# EAGLE design sparrow_v4.2 (EAGLE 9.7.0)
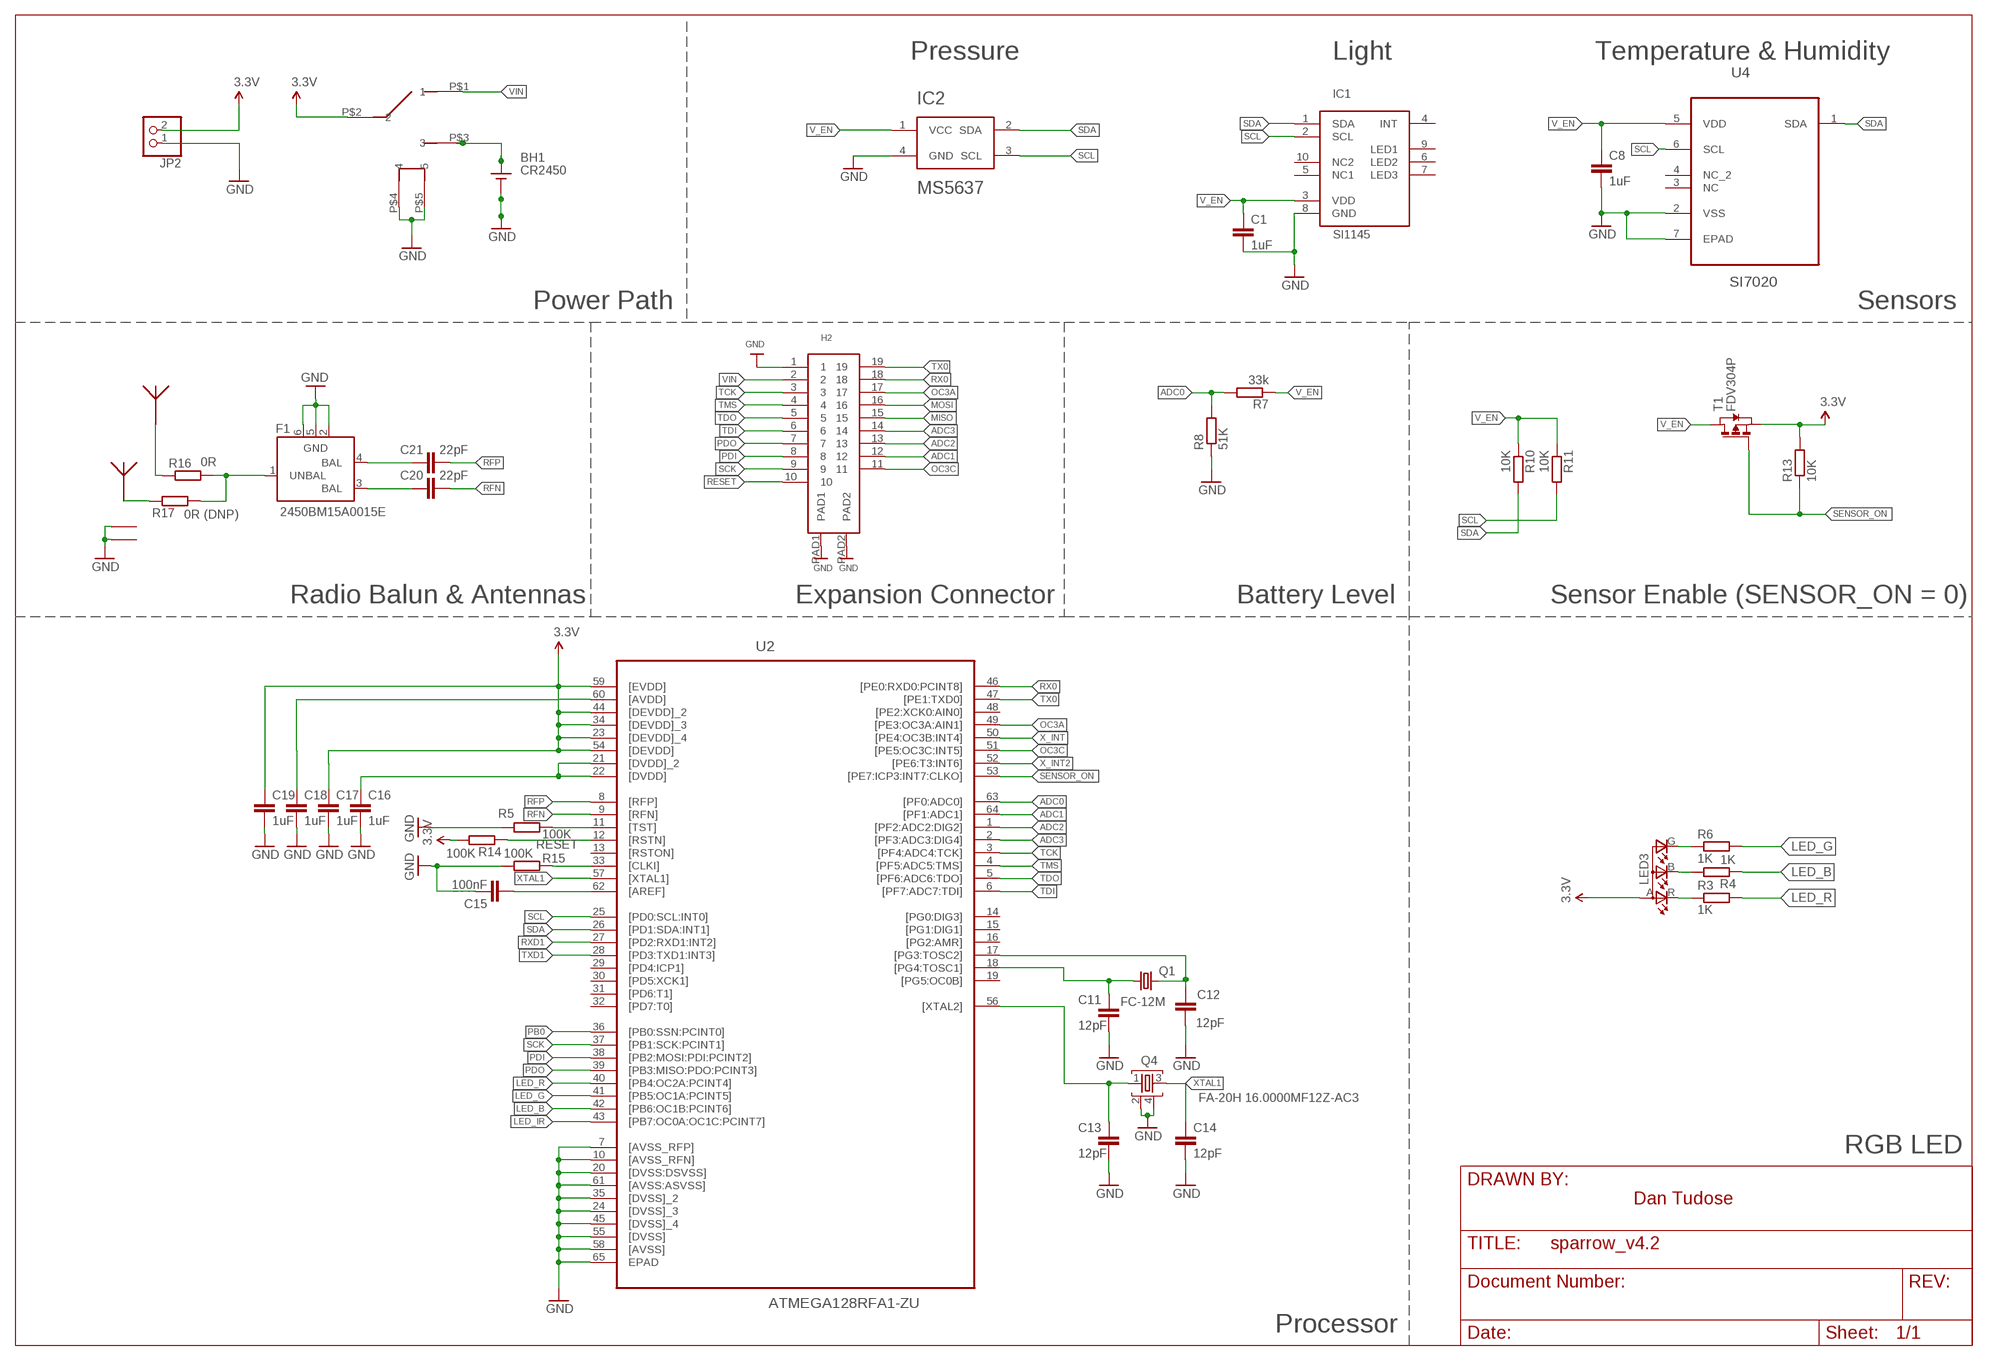
[diagram p0: schematic, sheet 1]

## Parts
C1  1uF  C-EUC0402  [C0402]
C8  1uF  C-EUC0402  [C0402]
C11  12pF  C-EUC0402  [C0402]
C12  12pF  C-EUC0402  [C0402]
C13  12pF  C-EUC0402  [C0402]
C14  12pF  C-EUC0402  [C0402]
C15  100nF  C-EUC0402  [C0402]
C16  1uF  C-EUC0402  [C0402]
C17  1uF  C-EUC0402  [C0402]
C18  1uF  C-EUC0402  [C0402]
C19  1uF  C-EUC0402  [C0402]
C20  22pF  C-EUC0402  [C0402]
C21  22pF  C-EUC0402  [C0402]
F1  2450BM15A0015E  2450BM15A0002  [2450BM15A0002]
H2  DF9-19P-1V(32)  [DF9-19P-1V(32)]
IC1  SI1145  [QFN10]
IC2  MS5637  [MS5637]
JP2  PINHD-1X2  [1X02]
LED3  LED_RGB_CREE_PLCC4  [P-LCC-4-4]
Q1  FC-12M  [FC-12M]
Q4  FA-20H 16.0000MF12Z-AC3  FA-20H  [FA-20H]
R3  1K  R-EU_R0402  [R0402]
R4  1K  R-EU_R0402  [R0402]
R5  100K  R-EU_R0402  [R0402]
R6  1K  R-EU_R0402  [R0402]
R7  33k  R-EU_R0402  [R0402]
R8  51K  R-EU_R0402  [R0402]
R10  10K  R-EU_R0402  [R0402]
R11  10K  R-EU_R0402  [R0402]
R13  10K  R-EU_R0402  [R0402]
R14  100K  R-EU_R0402  [R0402]
R15  100K  R-EU_R0402  [R0402]
R16  0R  R-EU_R0402  [R0402]
R17  0R (DNP)  R-EU_R0402  [R0402]
T1  FDV304P  PMOSSOT23  [SOT-23]
U1  SMTU2450N-LF  RENATA_BAT  [BATPACK]
U2  ATMEGA128RFA1-ZU  [QFN50P900X900X90-64N]
U4  SI7020  SHT21  [DFN300X300X110-7N]
U8  ANTENNA  [ANTPACK]
U10  UFL-R-SMT  [U.FLPACK]
U$1  SWITCH  [PCM12]

## Nets
3.3V: C17.1 C19.1 JP2.2 LED3.A(A2) R13.2 R14.2 T1.2(S) U2.23([DEVDD]_4) U2.34([DEVDD]_3) U2.44([DEVDD]_2) U2.54([DEVDD]) U2.59([EVDD]) U$1.P$2
ADC0: R7.2 R8.2 U2.63([PF0:ADC0])
ADC1: H2.12 U2.64([PF1:ADC1])
ADC2: H2.13 U2.1([PF2:ADC2:DIG2])
ADC3: H2.14 U2.2([PF3:ADC3:DIG4])
GND: C1.2 C8.2 C11.2 C12.2 C13.2 C14.2 C15.1 C16.2 C17.2 C18.2 C19.2 F1.2(GND) F1.5(GND) F1.6(GND) H2.1 H2.PAD1 H2.PAD2 IC1.8(GND) IC2.4(GND) JP2.1 Q4.2 Q4.4 R5.2 R8.1 R15.2 U1.P$2 U2.7([AVSS_RFP]) U2.10([AVSS_RFN]) U2.20([DVSS:DSVSS]) U2.24([DVSS]_3) U2.35([DVSS]_2) U2.45([DVSS]_4) U2.55([DVSS]) U2.58([AVSS]) U2.61([AVSS:ASVSS]) U2.65(EPAD) U4.2(VSS) U4.7(EPAD) U10.GND1 U10.GND2 U$1.P$4 U$1.P$5
LED_B: R4.1 U2.42([PB6:OC1B:PCINT6])
LED_G: R6.2 U2.41([PB5:OC1A:PCINT5])
LED_IR: U2.43([PB7:OC0A:OC1C:PCINT7])
LED_R: R3.2 U2.40([PB4:OC2A:PCINT4])
MISO: H2.15
MOSI: H2.16
N$1: U1.P$1 U$1.P$3
N$2: C16.1 U2.21([DVDD]_2) U2.22([DVDD])
N$3: LED3.R(CRED) R3.1
N$5: C12.1 Q1.2 U2.17([PG3:TOSC2])
N$6: C11.1 Q1.1 U2.18([PG4:TOSC1])
N$9: LED3.B(CBLUE) R4.2
N$10: LED3.G(CGREEN) R6.1
N$11: C18.1 U2.60([AVDD])
N$17: R5.1 U2.11([TST])
N$19: C13.1 Q4.1 U2.56([XTAL2])
N$22: R15.1 U2.33([CLKI])
N$23: C15.2 U2.62([AREF])
N$26: C20.1 F1.3(BAL)
N$27: C21.1 F1.4(BAL)
N$28: F1.1(UNBAL) R16.2 R17.1
N$29: R16.1 U8.P$1
N$30: R17.2 U10.P$1
OC3A: H2.17 U2.49([PE3:OC3A:AIN1])
OC3C: H2.11 U2.51([PE5:OC3C:INT5])
PB0: U2.36([PB0:SSN:PCINT0])
PDI: H2.8 U2.38([PB2:MOSI:PDI:PCINT2])
PDO: H2.7 U2.39([PB3:MISO:PDO:PCINT3])
RESET: H2.10 R14.1 U2.12([RSTN])
RFN: C20.2 U2.9([RFN])
RFP: C21.2 U2.8([RFP])
RX0: H2.18 U2.46([PE0:RXD0:PCINT8])
RXD1: U2.27([PD2:RXD1:INT2])
SCK: H2.9 U2.37([PB1:SCK:PCINT1])
SCL: IC1.2(SCL) IC2.3(SCL) R11.2 U2.25([PD0:SCL:INT0]) U4.6(SCL)
SDA: IC1.1(SDA) IC2.2(SDA) R10.2 U2.26([PD1:SDA:INT1]) U4.1(SDA)
SENSOR_ON: R13.1 T1.3(G) U2.53([PE7:ICP3:INT7:CLKO])
TCK: H2.3 U2.3([PF4:ADC4:TCK])
TDI: H2.6 U2.6([PF7:ADC7:TDI])
TDO: H2.5 U2.5([PF6:ADC6:TDO])
TMS: H2.4 U2.4([PF5:ADC5:TMS])
TX0: H2.19 U2.47([PE1:TXD0])
TXD1: U2.28([PD3:TXD1:INT3])
V_EN: C1.1 C8.1 IC1.3(VDD) IC2.1(VCC) R7.1 R10.1 R11.1 T1.1(D) U4.5(VDD)
VIN: H2.2 U$1.P$1
X_INT: U2.50([PE4:OC3B:INT4])
X_INT2: U2.52([PE6:T3:INT6])
XTAL1: C14.1 Q4.3 U2.57([XTAL1])
Unconnected: IC1.4(INT) IC1.5(NC1) IC1.6(LED2) IC1.7(LED3) IC1.9(LED1) IC1.10(NC2) U2.13([RSTON]) U2.14([PG0:DIG3]) U2.15([PG1:DIG1]) U2.16([PG2:AMR]) U2.19([PG5:OC0B]) U2.29([PD4:ICP1]) U2.30([PD5:XCK1]) U2.31([PD6:T1]) U2.32([PD7:T0]) U2.48([PE2:XCK0:AIN0]) U4.3(NC) U4.4(NC_2)

## Notes on the sheet
- Pressure | Light | Temperature & Humidity
- BH1
- CR2450
- Power Path | Sensors
- Radio Balun & Antennas | Expansion Connector | Battery Level | Sensor Enable (SENSOR_ON = 0)
- RGB LED
- DRAWN BY:
- Dan Tudose
- Processor

## Library data of the parts
C1 C8 C11-C21 = resistor:C-EU: CAPACITOR, European symbol
F1 = johanson:2450BM15A0002: 2.45 GHz Impedance Matched Balun-Filter For TI CC253X/CC2540 Chipset family Data sheet <http://www.johansontechnology.com/images/stories/ip/baluns/balun_filter_combo_matched_2450bm15a0002_v8.pdf>
H2 = dan:DF9-19P-1V(32)
IC1 = dan:SI1145
IC2 = dan:MS5637
JP2 = pinhead:PINHD-1X2: PIN HEADER
LED3 = led:LED_RGB_CREE_PLCC4
Q1 = crystal:FC-12M: kHz RANGE CRYSTAL UNIT LOW PROFILE SMD Source: Epson Toyocom FC-12M.pdf
Q4 = smartwatch:FA-: MHz RANGE CRYSTAL UNIT Source: Epson Toyocom
R3 R4 R6 = rcl:R-EU_: RESISTOR, European symbol
R5 R7 R8 R10 R11 R13-R17 = resistor:R-EU_: RESISTOR, European symbol
T1 = zetex:PMOSSOT23: MOS FET; OC_FARNELL: unknown; OC_NEWARK: unknown
U1 = 0andrei_custom:RENATA_BAT
U2 = Atmel_By_element14_Batch_1-00:ATMEGA128RFA1-ZU: 8-bit Microcontroller; DESCRIPTION: 8-bit Microcontroller; MPN: ATMEGA128RFA1-ZU; OC_FARNELL: 1841596; OC_NEWARK: -; PACKAGE: QFN-64; SUPPLIER: Atmel
U4 = sensirion:SHT21: SENSOR, HUMIDITY & TEMP; MPN: SHT21; OC_FARNELL: 1855468; OC_NEWARK: 20T1172; PACKAGE: DFN-6; SUPPLIER: SENSIRION
U8 = 0andrei_custom:ANTENNA
U10 = 0andrei_custom:UFL-R-SMT
U$1 = dan:SWITCH

## Board
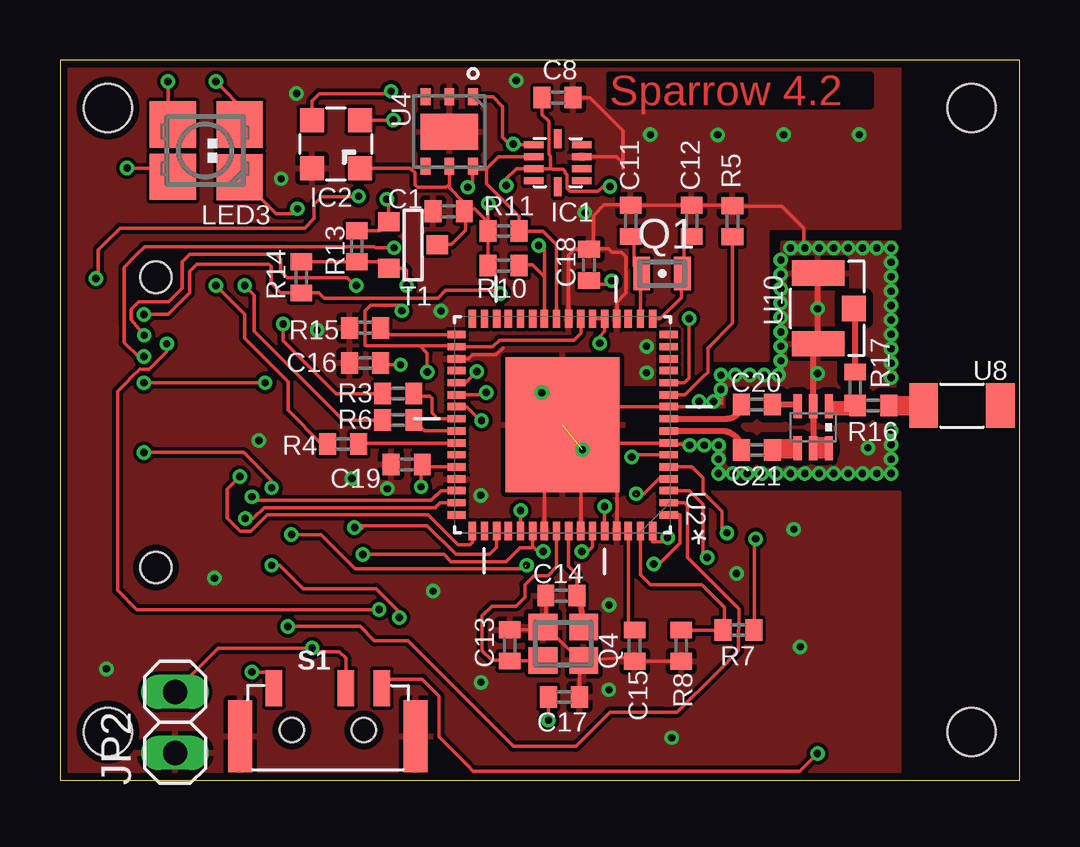
[diagram p1: board, top side]
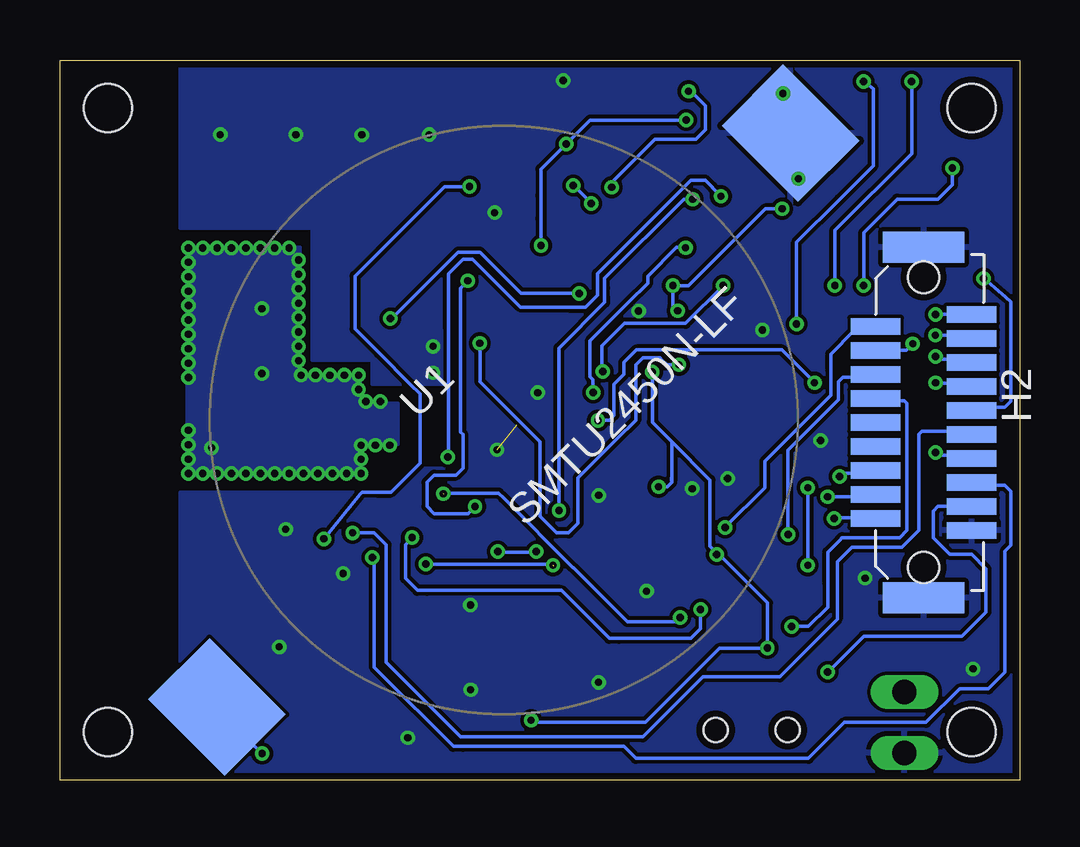
[diagram p2: board, bottom side, seen from below]

Size 40 x 30 mm. Coordinates in mm from the lower left corner, seen from the top.
Outline: 0,0 40,0 40,30 0,30 0,0
Copper layers (1*16): Top 0.035mm / dielectric 1.5mm / Bottom 0.035mm
Design rules "Fusion Electronics Design Rules": minimum track width 0.15mm, minimum drill 0.3mm, track to track 0.15mm, track to pad 0.15mm, pad to pad 0.15mm, via to via 0.15mm, smd to smd 0.15mm, copper to edge 0.3mm, drill to drill 0.2mm, minimum pad ring 0.2mm, minimum via ring 0.15mm, stop-mask expansion 0.075mm, vias tented up to drill 15mil, thermal gap 0.2mm
Holes 2 mm at 2,28 38,2 2,2 38,28

### Footprints (pad centres in the part's own frame; a part is rotated, then mirrored left to right if it is on the bottom)
C0402 = smd 0.7 x 0.9: 1 -0.65,0; 2 0.65,0
2450BM15A0002 = smd 0.35 x 1: 1 -0.65,-0.875; 2 0,-0.875; 3 0.65,-0.875; 4 0.65,0.875; 5 0,0.875; 6 -0.65,0.875
DF9-19P-1V(32) = smd 0.7 x 2.08: 1 -4.5,-2; 2 -3.5,-2; 3 -2.5,-2; 4 -1.5,-2; 5 -0.5,-2; 6 0.5,-2; 7 1.5,-2; 8 2.5,-2; 9 3.5,-2; 10 4.5,-2; 11 4,2; 12 3,2; 13 2,2; 14 1,2; 15 0,2; 16 -1,2; 17 -2,2; 18 -3,2; 19 -4,2 | smd 1.3 x 3.4: PAD1 7.3,0; PAD2 -7.3,0 | hole 1.3: 6.05,0; -6.05,0
QFN10 = smd 0.8 x 0.3: 1 1,1.5; 2 1,1; 3 1,0.5; 4 1,0; 6 3,0; 7 3,0.5; 8 3,1; 9 3,1.5 | smd 0.3 x 0.8: 5 2,-0.25; 10 2,1.75
MS5637 = smd 1 x 1: 1 -1,1; 2 -1,-1; 3 1,-1; 4 1,1
1X02 = drill 1.016 long: 1 -1.27,0; 2 1.27,0
P-LCC-4-4 = smd 1.93 x 1.93: A -1.088,-1.39; B -1.063,1.39; G 1.113,1.39; R 1.113,-1.39
FC-12M = smd 0.7 x 1.4: 1 -0.85,0; 2 0.85,0
FA-20H = smd 1.2 x 1.1: 1 -0.85,-0.7; 2 0.85,-0.7; 3 0.85,0.7; 4 -0.85,0.7
R0402 = smd 0.7 x 0.9: 1 -0.65,0; 2 0.65,0
SOT-23 = smd 0.787 x 0.889: 1 0.025,-1.016; 2 -0.94,1.016; 3 0.991,1.016
BATPACK = smd 3.6 x 4.5: P$1 -16.9,0; P$2 16.9,0
QFN50P900X900X90-64N = smd 0.762 x 0.305: 1 -4.42,3.759; 2 -4.42,3.251; 3 -4.42,2.743; 4 -4.42,2.261; 5 -4.42,1.753; 6 -4.42,1.245; 7 -4.42,0.762; 8 -4.42,0.254; 9 -4.42,-0.254; 10 -4.42,-0.762; 11 -4.42,-1.245; 12 -4.42,-1.753; 13 -4.42,-2.261; 14 -4.42,-2.743; 15 -4.42,-3.251; 16 -4.42,-3.759; 33 4.42,-3.759; 34 4.42,-3.251; 35 4.42,-2.743; 36 4.42,-2.261; 37 4.42,-1.753; 38 4.42,-1.245; 39 4.42,-0.762; 40 4.42,-0.254; 41 4.42,0.254; 42 4.42,0.762; 43 4.42,1.245; 44 4.42,1.753; 45 4.42,2.261; 46 4.42,2.743; 47 4.42,3.251; 48 4.42,3.759 | smd 0.305 x 0.762: 17 -3.759,-4.42; 18 -3.251,-4.42; 19 -2.743,-4.42; 20 -2.261,-4.42; 21 -1.753,-4.42; 22 -1.245,-4.42; 23 -0.762,-4.42; 24 -0.254,-4.42; 25 0.254,-4.42; 26 0.762,-4.42; 27 1.245,-4.42; 28 1.753,-4.42; 29 2.261,-4.42; 30 2.743,-4.42; 31 3.251,-4.42; 32 3.759,-4.42; 49 3.759,4.42; 50 3.251,4.42; 51 2.743,4.42; 52 2.261,4.42; 53 1.753,4.42; 54 1.245,4.42; 55 0.762,4.42; 56 0.254,4.42; 57 -0.254,4.42; 58 -0.762,4.42; 59 -1.245,4.42; 60 -1.753,4.42; 61 -2.261,4.42; 62 -2.743,4.42; 63 -3.251,4.42; 64 -3.759,4.42 | smd 4.75 x 5.639: 65 0,0
DFN300X300X110-7N = smd 0.711 x 0.406: 1 -1.448,0.991; 2 -1.448,0; 3 -1.448,-0.991; 4 1.448,-0.991; 5 1.448,0; 6 1.448,0.991 | smd 1.499 x 2.388: 7 0,0
ANTPACK = smd 1.2 x 1.85: P$1 -1.6,0; P$2 1.6,0
U.FLPACK = smd 1.05 x 2.2: GND1 -1.475,0; GND2 1.475,0 | smd 1.05 x 1: P$1 0,-1.5
PCM12 = smd 0.7 x 1.5: P$1 0,0; P$2 3,0; P$3 4.5,0 | smd 1 x 3: P$4 -1.4,-2; P$5 5.9,-2 | hole 1: 0.75,-1.75; 3.75,-1.75

### Placement (x,y rotation side)
C1  16.2,23.7 180 top
C8  20.74,28.43 0 top
C11  23.79,23.3 90 top
C12  26.33,23.3 90 top
C13  18.75,5.61 90 top
C14  20.9,7.68 180 top
C15  23.95,5.6 90 top
C16  12.72,17.38 180 top
C17  21.01,3.46 0 top
C18  22.05,21.46 90 top
C19  14.45,13.15 180 top
C20  29.05,15.65 180 top
C21  29.05,13.75 180 top
F1  31.4,14.7 180 top
H2  4,14.9 90 bottom
IC1  18.75,24.97 0 top
IC2  11.5,26.5 180 top
JP2  4.8,2.4 90 top
LED3  6.1,26.2 90 top
Q1  25.1,21.1 0 top
Q4  20.98,5.68 0 top
R3  14.1,16.1 0 top
R4  11.8,14 180 top
R5  28.03,23.28 90 top
R6  14.1,15 0 top
R7  28.28,6.25 180 top
R8  25.9,5.6 90 top
R10  18.49,21.43 0 top
R11  18.49,22.87 0 top
R13  12.38,22.24 270 top
R14  10.06,20.94 90 top
R15  12.72,18.84 180 top
R16  33.9,15.6 180 top
R17  33.15,16.35 90 top
T1  14.72,22.27 90 top
U1  21.5,15 45 bottom
U2  20.95,14.8 180 top
U4  16.23,27.02 270 top
U8  37.6,15.6 0 top
U10  31.6,19.65 90 top
U$1  8.92,3.83 0 top

### Tracks (layer width: path | path; a pad name or v marks a point on that pad's centre or on a via)
3.3V  (via drill 0.3)
  Top 0.15: 13.44,21.59 R13.2 R14.2 | 15.1,13.05 C19.1 | C19.1 15.05,13.15 v15.05,12.22 | v10.51,5.5 10.66,5.35 11.64,5.35 11.92,5.07 U$1.P$2 | 19.7,9.72 U2.54 | 19.7,9.72 19.65,9.68 19.38,9.68 19.18,9.68 19.1,9.6 18.6,9.1 16.3,9.1 16,9.4 12.6,9.4 v12.62,9.4 | v21.75,9.53 22,9.53 22.2,9.72 22.2,10.32 U2.59 | v20.15,9.53 19.9,9.53 19.75,9.68 19.7,9.72 | v14.45,20.6 14.45,21.25 14.38,21.32 13.82,21.32 T1.2 | v14.25,19.55 14.22,19.77 12.95,19.77 12.72,19.55 12.72,18.12 12.75,18.1 15,18.1 | JP2.2 4.8,3.7 6.6,5.5 v10.51,5.5 | v10.51,5.5 10.6,5.5 v10.51,5.5 | LED3.A 7.59,25.01 9,23.6 9.7,23.6 v9.9,23.8 | 15,18.1 15.1,18.1 16.5,18.1 | 16.5,18.1 16.53,18.1 | v15.31,17 15.31,17.79 15,18.1 | U2.23 21.71,18.61 21.43,18.33 18.32,18.33 18.04,18.05 U2.34 16.53,18.07 16.5,18.1 | U2.44 15.05,13.05 | 15.05,13.05 15,13.1 | 15.05,13.05 15.05,13.1 C19.1 | C17.1 v20.36,2.49
  Top 0.254: 13.44,21.59 T1.2 | U2.23
  Bottom 0.15: v21.75,9.53 21.43,9.5 20.27,9.5 v20.15,9.53 | 14.51,12.46 14.51,12.6 14.5,12.59 14.5,12.5 | 20.4,2.5 20.3,2.4 15.6,2.4 12.52,5.48 10.53,5.48 v10.51,5.5 10.51,7.38 12.58,9.45 v12.62,9.4 12.59,9.44 12.9,9.75 12.9,9.9 12.9,12.5 14.5,14.1 | 20.4,2.5 20.3,2.5 20.4,2.5 | v20.36,2.49 20.39,2.49 20.4,2.5 | v14.25,19.55 14.45,19.75 v14.45,20.6 13.8,20.6 10.6,23.8 v9.9,23.8 | 14.5,14.1 14.5,14 14.5,12.5 | 14.5,12.5 14.5,12.47 | v15.05,12.22 14.68,12.22 14.5,12.4 14.5,12.5 | v15.31,17 15.31,14.91 14.5,14.1
ADC0
  Top 0.15: U2.63 24.2,8.55 24.61,8.14 25.42,8.14 26.76,8.14 27.7,7.2 27.7,6.4 27.6,6.3 27.6,6.28 R7.2 R8.2
ADC1  (via drill 0.3)
  Top 0.15: v25.32,10.1 25.15,9.93 24.7,9.93 U2.64 | v4.45,18.18 4.45,17.85 3.73,17.12 3.33,17.12 2.98,16.77 2.8,16.6 2.4,16.2 2.4,7.9 3.2,7.1 3.3,7.1 v13.3,7.1
  Bottom 0.15: v4.45,18.18 4.72,17.9 H2.12 | v13.3,7.1 13.3,6.3 13.7,5.9 16.7,5.9 17.1,5.9 19.1,7.9 19.15,7.9 24.7,7.9 25.1,7.9 25.6,8.4 25.6,9.8 25.3,10.1 v25.32,10.1
ADC2  (via drill 0.3)  (1 unrouted)
  Top 0.15: v24.75,9 24.98,9 25.85,9.88 25.85,11.05 U2.1 | 19.6,9 19.55,8.95 v19.45,8.95 | v9.65,10.22 10.88,10.22 12.3,8.8 19.3,8.8 19.4,8.9
  Bottom 0.15: v19.45,8.95 19.6,9 23.27,9 24.7,9 v24.75,9 | H2.13 6.72,16.9 6.85,16.77 7.38,16.77 7.55,16.6 7.55,16.02 7.55,15.85 7.7,15.7 | v9.65,10.22 9.65,13.75 7.85,15.55 | 7.85,15.55 7.7,15.7 | 7.7,15.7 7.85,15.55
ADC3  (via drill 0.3)
  Top 0.15: U2.2 26.02,11.55 26.15,11.43 26.15,9.29 28.3,7.14 28.29,5.4 28.26,5.36 27.4,4.5 25.73,2.83 25.15,2.83 22.93,2.83 21.5,1.4 18.9,1.4 14.5,5.8 13.1,5.8 12.5,6.4 v9.5,6.4
  Bottom 0.15: H2.14 5.28,15.9 5.15,15.78 5.12,15.78 5.1,15.8 | 4.8,15.8 5.1,15.8 | 5.1,15.8 5.2,15.8 | 5.2,15.8 5.8,15.8 5.2,15.8 | 8.8,6.4 8,7.2 8,8.2 8,9.5 7.5,10 7.4,10.1 5,10.1 4.7,10.4 4.7,15.7 | v9.5,6.4 9,6.4 8.8,6.4 | v9.5,6.4 8.8,6.4 | 8.8,6.4 v9.5,6.4 | 4.7,15.7 4.8,15.8 | 4.8,15.8 4.7,15.7
GND  (via drill 0.3)  (1 unrouted)
  Top 0.15: 21.71,15.56 U2.10 26.44,15.56 v26.65,15.77 v27.25,15.77 27.53,15.77 27.6,15.7 27.6,16.22 v27.55,16.27 | U2.7 21.83,14.04 | U2.58 21.71,13.92 | U2.61 23.21,13.08 | U2.55 20.19,13.36 | C14.2 20.25,6.26 C13.2 | R8.1 C15.1 | C17.2 21.66,5.06 | Q4.2 23.8,5.11 | 21.55,5.11 20.78,5.87 20.7,5.95 20.56,5.95 Q4.4 | IC1.8 23.2,25.97 23.46,25.71 23.46,25.5 23.46,27.06 22.09,28.43 C8.2 | C11.2 C12.2 28.01,23.95 R5.2 | U2.24 21.2,21.87 21.44,22.11 C18.2 | 22.08,22.14 22.79,22.14 22.86,22.14 23,22 23.4,22 23.6,21.8 23.6,20.3 23.21,19.91 U2.20 | 23.46,23.96 22.68,23.96 22.24,23.52 22.24,22.3 | 7.15,2.58 7.15,1.85 7.14,1.85 | U2.35 17.03,17.54 17.2,17.71 17.6,17.71 18.18,17.71 18.46,17.99 | U2.65 20.95,15.3 20.11,16.14 | 20.11,16.14 20.08,16.17 | v20.08,16.14 20.11,16.14 | v26.25,13.95 26.13,13.97 26.1,14 25.4,14 | v26.85,13.95 v27.45,13.95 | v29.95,16.87 30.07,16.87 30.1,16.9 30.1,17.42 v30.05,17.47 v30.05,18.07 | v30.05,18.67 v30.05,19.27 | v30.05,21.07 v30.05,20.47 v30.05,21.07 | v30.05,21.07 v30.05,21.67 | v30.45,22.17 v31.05,22.17 | v31.05,22.17 v31.65,22.17 v32.25,22.17 | v32.85,22.17 v33.45,22.17 | 28.04,23.9 30.1,23.9 31,23 31,22.22 v31.05,22.17
  Top 0.254: F1.6 F1.5 F1.2 31.4,17.98 U10.GND1 U10.GND2 | 21.71,15.56 arc90 U2.65 arc90 21.71,14.04 21.83,14.04 arc90 21.71,13.92 | 23.21,13.08 arc90 21.56,14.73 arc90 20.19,13.36 | 21.66,5.06 Q4.2 21.55,5.11 | 23.8,5.11 C15.1 | 23.46,23.96 C11.2 | 22.08,22.14 C18.2 22.24,22.3 | 20.25,6.26 arc90 Q4.4 arc90 20.25,6.26
  Bottom 0.15: U1.P$2 9.55,28.29 v9.86,28.6 | v9.86,28.6 v9.87,28.61 v9.86,28.6
  other vias: 6.43,8.41 12.17,12.56 21.78,13.76 17.54,11.86 27.42,26.88 33.32,26.89 30.17,26.89 24.61,26.89 8.29,14.15 13.65,12.14 9.22,25.05 25.5,1.76 30.86,5.55 30.59,10.45 28.2,8.6 22.89,7.29 22.88,3.76 1.94,4.63 27.55,16.87 28.15,16.87 28.75,16.87 29.35,16.87 30.05,19.87 34.05,22.17 34.65,22.17 34.65,21.57 34.65,20.97 34.65,20.37 34.65,19.77 34.65,19.17 34.65,18.57 34.65,17.97 34.65,17.37 34.65,16.77 34.65,14.57 34.65,13.97 34.65,13.37 34.65,12.77 34.05,12.77 33.45,12.77 32.85,12.77 32.25,12.77 31.65,12.77 31.05,12.77 30.45,12.77 29.85,12.77 29.25,12.77 28.65,12.77 28.05,12.77 27.45,12.77 27.45,13.37 31.58,16.94 31.58,19.64 33.68,13.84 21.88,23.64 10.72,18.75 19.02,29.15 15.88,19.54 24.45,18.07 24.45,16.97 15.55,7.87 17.55,4.07
  pour Top (isolate 0.305): 27.39,13.97 27.4,13.94 27.4,12.7 34.7,12.7 34.7,13.84 34.71,13.87 34.73,13.89 34.76,13.9 34.8,13.9 34.8,22.4 30.1,22.4 30.1,16.96 30.09,16.93 30.07,16.91 30.04,16.9 27.6,16.9 27.6,15.76 27.59,15.73 27.57,15.71 27.54,15.7 26.4,15.7 26.4,15.56 26.39,15.53 26.37,15.51 26.34,15.5 25.3,15.5 25.3,14 27.34,14 27.37,13.99
  pour Bottom: 27,12.06 27,13 23.56,13 23.53,13.01 23.51,13.03 23.5,13.06 23.5,16.44 23.51,16.47 23.53,16.49 23.56,16.5 27,16.5 27,17.44 27.01,17.47 27.03,17.49 27.06,17.5 29.5,17.5 29.5,22.94 29.51,22.97 29.53,22.99 29.56,23 35,23 35,30 0,30 0,0 35,0 35,12 27.06,12 27.03,12.01 27.01,12.03
  pour Top: 27,12.06 27,13 23.56,13 23.53,13.01 23.51,13.03 23.5,13.06 23.5,16.44 23.51,16.47 23.53,16.49 23.56,16.5 27,16.5 27,17.44 27.01,17.47 27.03,17.49 27.06,17.5 29.5,17.5 29.5,22.94 29.51,22.97 29.53,22.99 29.56,23 35,23 35,30 0,30 0,0 35,0 35,12 27.06,12 27.03,12.01 27.01,12.03
  pour Bottom: 27.49,13.97 27.5,13.94 27.5,12.7 34.7,12.7 34.7,22.2 30,22.2 30,16.86 29.99,16.83 29.97,16.81 29.94,16.8 27.5,16.8 27.5,15.76 27.49,15.73 27.47,15.71 27.44,15.7 25.9,15.7 25.9,14 27.44,14 27.47,13.99
LED_B
  Top 0.15: U2.42 12.8,14.04 | 12.8,14.04 12.64,14.04 12.6,14 | R4.1 12.76,14 12.8,14.04
LED_G
  Top 0.15: U2.41 15.2,14.55 R6.2
LED_R
  Top 0.15: U2.40 15.75,15.05 15.5,15.3 15.5,15.9 15.4,16 14.85,16 R3.2
N$1  (via drill 0.3)
  Top 0.15: v31.57,1.1 30.85,0.38 21.55,0.38 17.23,0.38 17,0.6 15.8,1.8 15.8,3.5 15.1,4.2 13.4,4.2 13.4,3.9 13.45,3.85 | 13.45,3.85 13.5,3.8 | U$1.P$3 13.45,3.85
  Bottom 0.15: v31.57,1.1 33,2.52 32.98,2.55 33.45,3.02 U1.P$1
N$2  (via drill 0.3)
  Top 0.15: U2.22 U2.21 22.7,18.7 22.5,18.5 v22.5,18.2 | C16.1 13.37,17.47 13.6,17.7 13.6,17.5 13.4,17.3 v14.2,17.3
  Bottom 0.15: v14.2,17.3 14.7,17.3 14.9,17.5 15,17.6 15.7,17.6 16,17.3 16,15 16.8,14.2 18.4,12.6 18.4,10.7 18.8,10.3 19.3,10.3 20,11 20,14.1 21.3,15.4 22.5,16.6 v22.5,18.2
N$3  (via drill 0.3)
  Top 0.15: R3.1 11.5,16.1 11,16.6 9.3,18.3 v9.3,19 | v6.5,29.1 6.7,28.9 7.6,28 7.59,28.01 LED3.R
  Bottom 0.15: v9.3,19 9.3,22.4 7.5,24.2 6.1,25.6 6.1,28.8 v6.5,29.1
N$5
  Top 0.15: U2.17 24.96,19.22 25.02,19.22 25.9,20.1 25.9,21 26,21.1 | 26.12,21.12 26,21 26,21.05 Q1.2 26,21.1 | 26,21.1 26,22.32 C12.1
N$6
  Top 0.15: U2.18 24.2,20.04 24.2,21 | C11.1 23.92,22.52 23.92,21.43 Q1.1 24.25,21.05 24.2,21 | 24.2,21 24.2,21.2
  Top 0.254: 23.82,22.62 C11.1
N$7
  Top 0.6: 34.6,15.7 35.5,15.7 34.6,15.7 | 34.6,15.7 34.6,15.5 35.5,15.5
N$8
  Top 0.6: 33.1,15.5 32.3,15.5
N$9  (via drill 0.3)
  Top 0.15: R4.2 10.9,14 9.5,15.4 9.5,16.6 8.9,17.2 7.7,18.4 7.7,19.4 v6.5,20.6 | LED3.B 4.24,25.38 | 4.24,25.38 4.14,25.44 | v2.8,25.5 4.2,25.5 4.3,25.4 4.26,25.4 4.24,25.38
  Bottom 0.15: v2.8,25.5 2.8,24.8 | v6.5,20.6 6.5,22.8 5.1,24.2 3.4,24.2 2.9,24.7 | 2.9,24.7 2.8,24.8 | 2.8,24.8 2.9,24.7
N$10  (via drill 0.3)
  Top 0.15: v7.7,20.6 8.1,20.2 8.1,18.7 10.1,16.7 11.8,15 R6.1 | v4.5,29.1 4.5,28.3 4.8,28 LED3.G | R6.1 13.5,15 R6.1
  Bottom 0.15: v7.7,20.6 7.7,22.3 7.7,22.9 4.5,26.1 v4.5,29.1
N$11  (via drill 0.3)
  Top 0.15: 22.2,20.66 22.77,20.66 v23,20.8 | v22.7,11.4 U2.60
  Top 0.254: 22.2,20.66 C18.1
  Bottom 0.15: v23,20.8 23.3,20.5 23.3,14.5 23.2,14.4 23.2,13 23.5,12.7 24.4,12.7 24.7,12.4 24.7,11.4 24.4,11.1 23,11.1 v22.7,11.4
N$13
  Top 0.6: 29.7,13.9 30.5,13.9
N$14
  Top 0.6: 30.6,13.8 30.6,13.7 29.8,13.7
N$15
  Top 0.6: 31.6,14 31.9,14 31.9,13.9 31.9,13.7 31.6,13.7
N$17
  Top 0.15: R5.1 28.03,19.03 27,18 27,17 26.8,16.8 26.05,16.05 U2.11
N$19
  Top 0.15: U2.56 20.7,8.88 20.34,8.52 19.76,8.52 19.38,8.14 19.38,7.61 19.01,7.24 18,7.24 17.6,6.84 17.6,5.39 18.01,4.98 18.79,4.98 18.8,4.97 C13.1 20.11,4.96 Q4.1
N$22
  Top 0.15: U2.33 13.65,18.56
  Top 0.254: 13.65,18.56 R15.1
N$23
  Top 0.15: U2.62 23.69,6.51
  Top 0.254: 23.69,6.51 arc90 C15.2
N$26
  Top 0.254: C20.1 30.68,15.65 arc-90 F1.3
N$27
  Top 0.254: C21.1 30.68,13.75 arc90 F1.4
N$28
  Top 0.254: F1.1 33.02,15.57 arc90 R17.1 arc-90 R16.2
N$29
  Top 0.254: R16.1 U8.P$1
N$30
  Top 0.254: R17.2 33.15,19.6 arc90 U10.P$1
OC3A  (via drill 0.3)
  Top 0.15: v7.5,12.65 6.97,12.12 6.97,10.9 7.5,10.38 7.95,10.38 8.62,11.05 12.45,11.05 12.55,11.05 15.35,11.05 16.6,9.8 17.1,9.8 17.2,9.9 17.2,10.4 U2.49
  Bottom 0.15: v7.5,12.65 7.38,12.78 6.85,12.78 6.72,12.9 H2.17
OC3C  (via drill 0.3)
  Top 0.15: 18.2,10.4 U2.51 18.2,10.5 18.2,9.7 17.9,9.4 16.5,9.4 15.3,10.6 12.4,10.6 12.3,10.5 | 12.6,10.5 12.3,10.5 | v12.28,10.53 12.3,10.5
  Bottom 0.15: v12.28,10.53 10.62,12.18 10.62,13.28 7.9,16 7.88,16.02 7.88,16.45 7.88,17.07 7.88,17.75 6.91,18.71 6.9,18.71 6.71,18.9 | H2.11 6.71,18.9 | 6.71,18.9 6.72,18.9 | 6.71,18.9 6.71,18.88 6.73,18.86 6.76,18.86 6.77,18.85 6.77,18.83 6.77,18.82 6.79,18.8 6.83,18.8 7,18.63
PDI  (via drill 0.3)
  Top 0.15: 17.62,16.2 v17.77,16.15 17.73,16.1 17.7,16.1 17.65,16.05 16.55,16.05 U2.38 | v13.93,22.18 13.15,22.18 13.1,22.23 9.35,22.23 3.52,22.23 3.5,22.2 3.2,21.9 2.67,21.38 2.67,19.75 2.67,19.05 2.67,18.23 2.7,18.2 3.25,17.65 v3.5,17.65
  Bottom 0.15: v17.77,16.15 17.77,16.68 17.9,16.8 17.9,18.3 16.3,19.9 15.5,20.7 15.5,21 14.3,22.2 13.9,22.2 13.9,22.1 13.93,22.12 v13.93,22.18 | v3.5,17.65 3.38,17.52 2.85,17.52 2.73,17.4 H2.8
PDO  (via drill 0.3)
  Top 0.15: v3.5,16.55 v8.55,16.55 | U2.39 16.55,15.55 16.93,15.55 16.95,15.55 17.5,15 17.52,14.97 v17.57,14.97
  Bottom 0.15: 14.12,17.93 14.17,17.93 | 14.17,17.93 14.88,17.93 15.97,17.93 16,17.9 16.5,17.4 16.5,16.9 16.9,16.5 16.9,15.2 17.1,15 17.5,15 | v3.5,16.55 3.48,16.52 2.85,16.52 2.73,16.4 H2.7 | v8.55,16.55 8.52,16.54 9.9,17.92 14.14,17.92 14.16,17.92 14.17,17.93 | 17.5,15 17.6,15 | v17.57,14.97 17.52,14.97 17.5,15
RESET  (via drill 0.3)
  Top 0.15: v26.23,19.23 26.23,16.75 26.02,16.55 U2.12 | 9.4,20.3 10,20.3 R14.1 10.07,20.3 10.78,20.3 11,20.07 15.75,20.07 16.07,20.4 17.43,20.4 18.2,20.4 18.3,20.3 18.32,20.27 v18.35,20.27 | 9.4,20.3 9.35,20.3 | v3.5,19.4 4.5,19.4 5.4,20.3 5.4,21.2 5.7,21.5 8.7,21.5 8.8,21.4 8.8,20.7 9.2,20.3 9.4,20.3
  Bottom 0.15: v3.5,19.4 H2.10 | v26.23,19.23 26.2,19.2 25.1,20.3 23.4,22 22.5,22 20.77,20.27 v18.35,20.27
RFN
  Top 0.254: U2.9 27.8,15.05 arc90 C20.2
RFP
  Top 0.254: U2.8 27.6,14.55 arc-90 C21.2
RX0  (via drill 0.3)
  Top 0.15: U2.46 15.88,12.05 15.68,11.85 15.68,11.86 15.47,11.65 12.85,11.65 8.15,11.65 v8,11.8
  Bottom 0.15: v8,11.8 6.1,11.8 H2.18
SCK  (via drill 0.3)
  Top 0.15: v17.38,17.02 16.9,16.55 16.55,16.55 U2.37 | v3.51,18.53 2.98,19.18 2.98,19.62 3.27,19.93 3.73,19.93 4.53,19.93 5,20.4 5.1,20.5 5.1,21.6 5.4,21.9 9,21.9 9.2,21.7 9.2,21.2 9.4,21 9.47,20.93 10.78,20.93 11.97,20.93 12.3,20.6 v12.35,20.6
  Bottom 0.15: v12.35,20.6 13.93,19.02 16.48,19.02 17.4,18.1 17.4,17 v17.38,17.02 | v3.51,18.53 3.38,18.52 2.85,18.52 2.73,18.4 H2.9
SCL  (via drill 0.3)
  Top 0.15: IC1.2 18.28,25.97 17.76,25.45 | 17.76,25.45 17.24,25.45 | U2.25 20.7,22.29 20.13,22.86 R11.2 | R11.2 19.14,23.49 17.79,24.84 17.79,25.42 17.76,25.45 | IC2.3 10.5,28.3 10.8,28.6 13.7,28.6 v13.8,28.7 | v17,24.7 17.1,24.8 17.2,24.9 17.2,25.45 U4.6
  Top 0.254: 17.24,25.45 U4.6 | R11.2
  Bottom 0.15: v13.8,28.7 13.7,28.7 13.1,28.1 13.1,27.1 13.5,26.7 15.1,26.7 15.2,26.7 17,24.9 v17,24.7
SDA  (via drill 0.3)
  Top 0.15: U4.1 18.04,28.47 18.45,28.06 18.45,26.78 18.76,26.47 18.9,26.47 | 18.9,26.47 19.67,26.47 | 20.19,20.96 20.12,21.02 | 20.12,21.02 19.69,21.46 19.17,21.46 | 19.15,21.57 R10.2 | v18.9,26.5 18.9,26.47 | v19.95,22.27 20.02,22.27 20.2,22.1 20.2,21 | U2.26 20.19,20.99 20.2,21 | 20.2,21 20.15,21 20.12,21.02 | IC2.2 v13.9,27.5
  Top 0.254: IC1.1 19.67,26.47 IC1.1 | IC1.1 | 19.17,21.46 R10.2
  Bottom 0.15: v19.95,22.27 19.95,23.4 19.95,24.35 19.95,25.45 v18.9,26.5 17.9,27.5 v13.9,27.5
SENSOR_ON  (via drill 0.3)
  Top 0.15: R13.1 13.33,22.89 T1.3 | v19.2,11.22 19.2,10.4 U2.53 | 13.78,23.25 T1.3 | T1.3 13.7,24.1 13.65,24.15 | 13.65,24.15 13.6,24.2 | v13.62,24.2 13.62,24.18 13.65,24.15
  Bottom 0.15: v19.2,11.22 19.2,18 17.3,19.9 17.3,20.1 17.3,20.5 17.3,20.9 14,24.2 v13.62,24.2 | v13.62,24.2 13.6,24.2 v13.62,24.2
TCK  (via drill 0.3)
  Top 0.15: U2.3 26.24,12.06 26.8,11.5 26.8,9.4 26.9,9.3 26.93,9.28 v26.98,9.28
  Bottom 0.15: H2.3 1.27,12.4 1.15,12.28 0.62,12.28 0.38,12.03 0.38,9.78 0.55,9.6 0.55,9.59 0.61,9.53 0.61,7.09 0.61,4.49 1.3,3.8 2.5,3.8 3.9,2.4 7.3,2.4 8.8,0.9 16,0.9 16.5,1.4 23.2,1.4 23.6,1.4 26.7,4.5 26.9,4.7 26.9,9.2 | v26.98,9.28 27,9.2 26.9,9.2 | 26.9,9.2 26.9,9.3 26.9,9.2
TDI  (via drill 0.3)
  Top 0.15: U2.6 25.35,13.55 24.57,13.55 23.95,13.55 23.9,13.5 23.86,13.46 v23.84,13.46 | v1.5,20.9 1.6,21 1.6,22.1 1.82,22.32 2.5,23 6.7,23 10.2,23 10.6,23.4 10.6,24 10.9,24.3 12.4,24.3 12.43,24.3 v12.45,24.32
  Bottom 0.15: v1.5,20.9 0.57,20.12 0.38,19.93 0.38,15.78 0.62,15.53 1.15,15.53 1.27,15.4 H2.6 | v23.84,13.46 23.84,13.54 23.8,13.5 23.8,15.7 23.8,18.8 23.8,21.1 23.2,21.7 22.8,21.7 20.8,19.7 18.8,19.7 18.1,19.7 17.6,20.2 17.6,21.1 15.5,23.2 13.7,25 13.1,25 12.8,24.7 12.8,24.68 v12.45,24.32
TDO  (via drill 0.3)
  Top 0.15: U2.5 26.25,13.05 26.35,13.05 26.8,12.6 26.8,12.3 26.8,12 27.6,11.2 27.6,10.5 v27.8,10.3
  Bottom 0.15: H2.5 2.73,14.4 2.85,14.53 3.38,14.53 4.08,14.53 4.2,14.4 4.2,10.4 4.9,9.7 7,9.7 7.6,9.1 7.6,6.7 10,4.3 13.2,4.3 15.6,1.9 15.7,1.8 23.3,1.8 26.4,4.9 26.4,9.8 26.9,10.3 v27.8,10.3
TMS  (via drill 0.3)  (1 unrouted)
  Top 0.15: v14.15,6.78 14.05,7.1 13.18,7.97 10.22,7.97 10.12,7.97 9.9,8.2 | 9.9,8.2 9.15,8.95 v8.82,8.95 | 9.9,8.2 9.95,8.15 | v8.82,12.18 8.82,12.47 8.8,12.5 7.65,13.65 v3.5,13.65 | U2.4 25.35,12.55 24.98,12.55 24.85,12.43 24.35,11.93 v24.02,11.93
  Bottom 0.15: 14.12,6.78 v14.15,6.78 14.22,6.6 16.35,6.6 18.59,8.84 18.6,8.85 18.61,8.85 21.52,11.76 21.71,11.95 23.95,11.95 24,11.9 | v8.82,12.18 v8.82,8.95 | v3.5,13.65 3.38,13.53 2.85,13.53 2.73,13.4 H2.4
TX0  (via drill 0.3)
  Top 0.15: v7.72,10.9 8.05,10.9 8.5,11.35 12.75,11.35 15.65,11.35 15.7,11.4 15.85,11.55 15.88,11.55 U2.47
  Bottom 0.15: v7.72,10.9 7.7,10.93 6.75,10.93 6.72,10.9 H2.19
V_EN  (via drill 0.3)
  Top 0.15: C1.1 17.28,23.8 17.84,23.24 17.85,23.35 v17.85,24.02 | R10.1 R11.1 | 20.45,25.5 20.43,25.48 IC1.3 19.7,25.48 19.02,25.48 18.6,25.05 v18.6,24.77 | 20.45,25.5 20.45,26 20.38,26.07 20.38,27.45 20.1,27.73 C8.1 | v29,10.05 29,10.07 28.95,9.82 28.95,6.42 28.98,6.25 R7.1 | v22.93,24.73 22.62,24.73 22.43,24.52 21.25,24.52 21.12,24.65 21.12,25.23 21.05,25.3 21.05,25.38 20.98,25.45 20.5,25.45 20.45,25.5 | 13.2,25.5 13,25.5 | 13,25.5 IC2.1 | 13,25.5 14.6,25.5 14.8,25.3 14.8,24.8 14.9,24.7 16.1,24.7 16.23,24.83 U4.5 16.23,24.67 16.8,24.1 16.8,23.8 16.85,23.75 C1.1 | 15.74,22.33 16.33,22.33 16.9,22.9 16.9,23.65 C1.1
  Top 0.254: T1.1 15.74,22.33 | R11.1 17.84,23.24
  Bottom 0.15: v22.93,24.73 23.98,24.73 24,24.7 27.7,21 27.7,18.8 26.7,17.8 25.4,16.5 25,16.1 25,13.2 26.2,12 26.8,12 27.4,12 27.5,11.9 v29,10.05 | v18.6,24.77 v17.85,24.02
VIN  (via drill 0.3)
  Top 0.15: v8,4.5 8.7,4.5 9,4.2 9,3.8 8.95,3.8 U$1.P$1
  Bottom 0.15: H2.2 3.4,11.4 3.6,11.2 3.6,10.1 2.9,9.4 2,9.4 1.4,8.8 1.4,7 1.9,6.5 2.4,6 6.5,6 v8,4.5
XTAL1
  Top 0.15: U2.57 21.2,8.91 21.56,8.55 C14.1
  Top 0.254: Q4.3 21.7,7.53 C14.1

### Text on the board
Top: Sparrow 4.2
tNames: S1
tStop: Sparrow 4.2